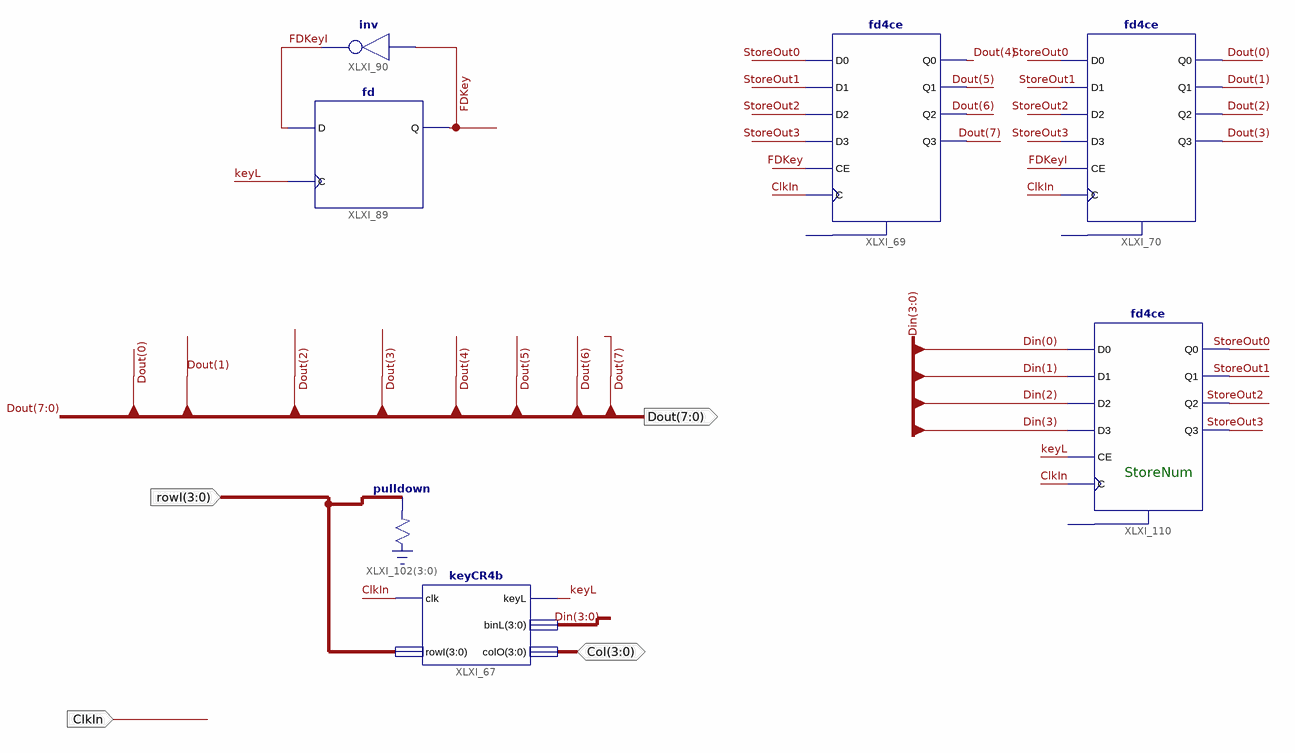
[diagram p0: schematic sheet 1]
// Xilinx ISE schematic KeyPad.sch (spartan3e) as structural Verilog: 7 symbols, 4 ports
module KeyPad (
  input  [3:0] rowI,
  input  ClkIn,
  inout  [3:0] Col,
  output [7:0] Dout
);

  wire FDKey, FDKeyI, keyL, StoreOut0, StoreOut1, StoreOut2, StoreOut3;
  wire [3:0] Din;

  fd XLXI_89 (.C(keyL), .D(FDKeyI), .Q(FDKey));
  not XLXI_90 (FDKeyI, FDKey);
  fd4ce XLXI_110 (
    .C(ClkIn), .CE(keyL), .D0(Din[0]), .D1(Din[1]), .D2(Din[2]), .D3(Din[3]), .Q0(StoreOut0), .Q1(StoreOut1),
    .Q2(StoreOut2), .Q3(StoreOut3));  // open: CLR
  fd4ce XLXI_69 (
    .C(ClkIn), .CE(FDKey), .D0(StoreOut0), .D1(StoreOut1), .D2(StoreOut2), .D3(StoreOut3), .Q0(Dout[4]),
    .Q1(Dout[5]), .Q2(Dout[6]), .Q3(Dout[7]));  // open: CLR
  fd4ce XLXI_70 (
    .C(ClkIn), .CE(FDKeyI), .D0(StoreOut0), .D1(StoreOut1), .D2(StoreOut2), .D3(StoreOut3), .Q0(Dout[0]),
    .Q1(Dout[1]), .Q2(Dout[2]), .Q3(Dout[3]));  // open: CLR
  \pulldown  XLXI_102[3:0] (.O(rowI));
  keyCR4b XLXI_67 (.clk(ClkIn), .rowI(rowI), .colO(Col), .keyL(keyL), .binL(Din));

  // Notes on the sheet:
  //   StoreNum
endmodule
